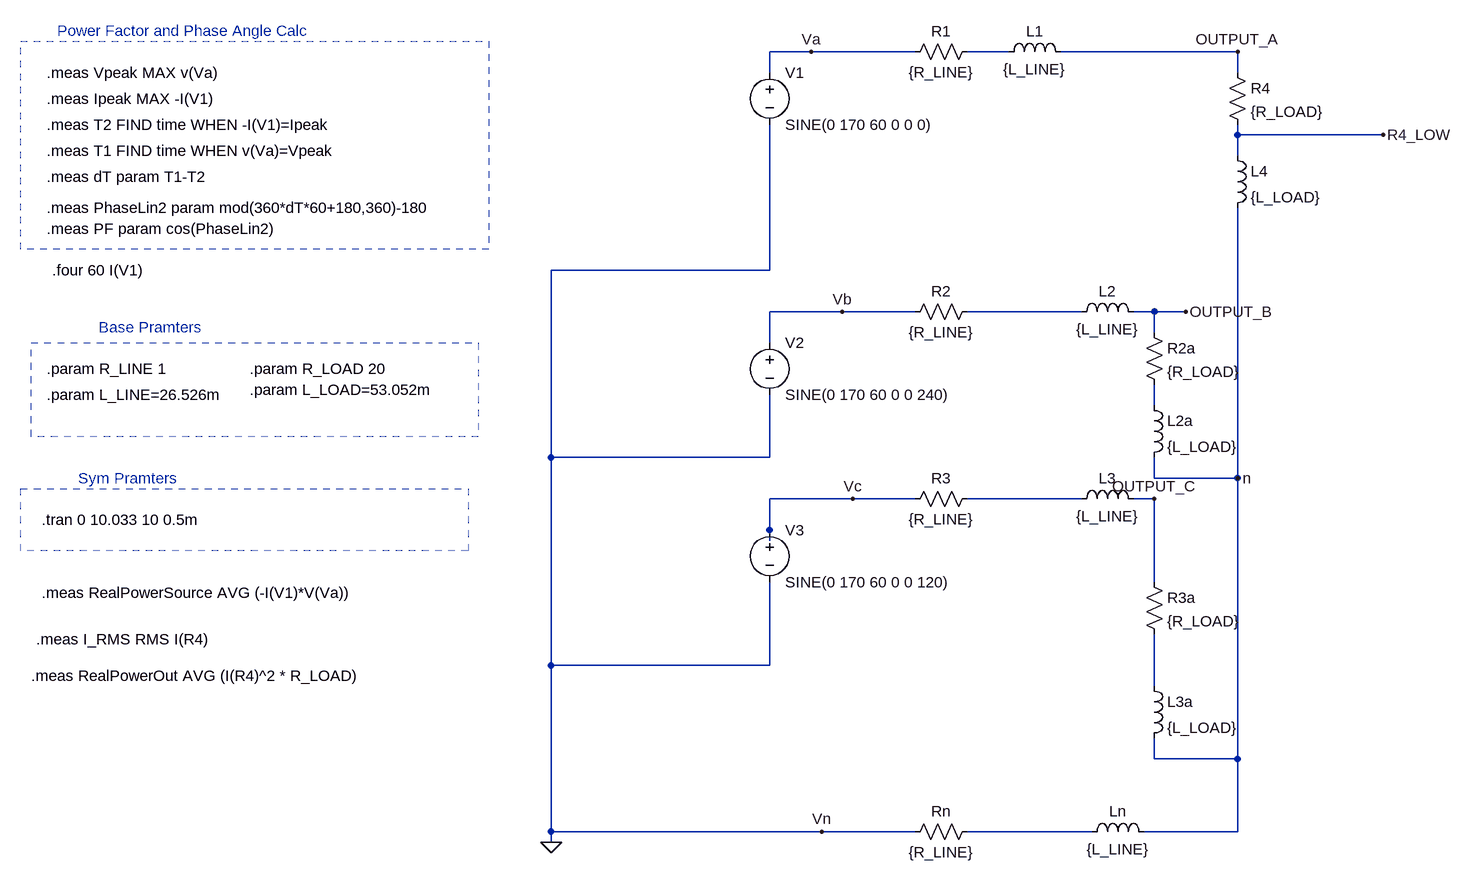
[diagram p0: schematic EE242_lab4.asc]
EE242_lab4.asc, the LTspice schematic file:
Version 4
SHEET 1 1396 1336
WIRE 192 -96 128 -96
WIRE 352 -96 192 -96
WIRE 496 -96 432 -96
WIRE 848 -96 576 -96
WIRE 128 -64 128 -96
WIRE 848 -64 848 -96
WIRE 848 32 848 16
WIRE 1072 32 848 32
WIRE 848 64 848 32
WIRE 128 240 128 16
WIRE 128 240 -208 240
WIRE 240 304 128 304
WIRE 352 304 240 304
WIRE 608 304 432 304
WIRE 720 304 688 304
WIRE 768 304 720 304
WIRE 720 336 720 304
WIRE 128 352 128 304
WIRE 720 448 720 416
WIRE -208 528 -208 240
WIRE 128 528 128 432
WIRE 128 528 -208 528
WIRE 720 560 720 528
WIRE 848 560 848 144
WIRE 848 560 720 560
WIRE 256 592 128 592
WIRE 352 592 256 592
WIRE 608 592 432 592
WIRE 720 592 688 592
WIRE 128 640 128 592
WIRE 128 656 128 640
WIRE 720 720 720 592
WIRE -208 848 -208 528
WIRE 128 848 128 720
WIRE 128 848 -208 848
WIRE 720 880 720 800
WIRE 720 992 720 960
WIRE 848 992 848 560
WIRE 848 992 720 992
WIRE -208 1104 -208 848
WIRE 208 1104 -208 1104
WIRE 352 1104 208 1104
WIRE 624 1104 432 1104
WIRE 848 1104 848 992
WIRE 848 1104 704 1104
WIRE -208 1120 -208 1104
FLAG -208 1120 0
FLAG 240 304 Vb
FLAG 256 592 Vc
FLAG 208 1104 Vn
FLAG 848 560 n
FLAG 720 592 OUTPUT_C
FLAG 768 304 OUTPUT_B
FLAG 848 -96 OUTPUT_A
FLAG 192 -96 Va
FLAG 1072 32 R4_LOW
SYMBOL voltage 128 336 R0
SYMATTR InstName V2
SYMATTR Value SINE(0 170 60 0 0 240)
SYMBOL voltage 128 624 R0
SYMATTR InstName V3
SYMATTR Value SINE(0 170 60 0 0 120)
SYMBOL res 448 576 R90
WINDOW 0 0 56 VBottom 2
WINDOW 3 32 56 VTop 2
SYMATTR InstName R3
SYMATTR Value {R_LINE}
SYMBOL res 448 288 R90
WINDOW 0 0 56 VBottom 2
WINDOW 3 32 56 VTop 2
SYMATTR InstName R2
SYMATTR Value {R_LINE}
SYMBOL res 448 1088 R90
WINDOW 0 0 56 VBottom 2
WINDOW 3 32 56 VTop 2
SYMATTR InstName Rn
SYMATTR Value {R_LINE}
SYMBOL ind 608 1120 R270
WINDOW 0 32 56 VTop 2
WINDOW 3 5 56 VBottom 2
SYMATTR InstName Ln
SYMATTR Value {L_LINE}
SYMBOL ind 592 608 R270
WINDOW 0 32 56 VTop 2
WINDOW 3 5 56 VBottom 2
SYMATTR InstName L3
SYMATTR Value {L_LINE}
SYMBOL ind 592 320 R270
WINDOW 0 32 56 VTop 2
WINDOW 3 5 56 VBottom 2
SYMATTR InstName L2
SYMATTR Value {L_LINE}
SYMBOL ind 704 432 R0
SYMATTR InstName L2a
SYMATTR Value {L_LOAD}
SYMBOL ind 704 864 R0
SYMATTR InstName L3a
SYMATTR Value {L_LOAD}
SYMBOL res 704 704 R0
SYMATTR InstName R3a
SYMATTR Value {R_LOAD}
SYMBOL res 704 320 R0
SYMATTR InstName R2a
SYMATTR Value {R_LOAD}
SYMBOL res 448 -112 R90
WINDOW 0 0 56 VBottom 2
WINDOW 3 32 56 VTop 2
SYMATTR InstName R1
SYMATTR Value {R_LINE}
SYMBOL ind 480 -80 R270
WINDOW 0 32 56 VTop 2
WINDOW 3 5 56 VBottom 2
SYMATTR InstName L1
SYMATTR Value {L_LINE}
SYMBOL res 832 -80 R0
SYMATTR InstName R4
SYMATTR Value {R_LOAD}
SYMBOL ind 832 48 R0
SYMATTR InstName L4
SYMATTR Value {L_LOAD}
SYMBOL voltage 128 -80 R0
SYMATTR InstName V1
SYMATTR Value SINE(0 170 60 0 0 0)
TEXT -992 624 Left 2 !.tran 0 10.033 10 0.5m
TEXT -984 392 Left 2 !.param R_LINE 1
TEXT -984 432 Left 2 !.param L_LINE=26.526m
TEXT -672 392 Left 2 !.param R_LOAD 20
TEXT -672 424 Left 2 !.param L_LOAD=53.052m
TEXT -984 -64 Left 2 !.meas Vpeak MAX v(Va)
TEXT -984 -24 Left 2 !.meas Ipeak MAX -I(V1)
TEXT -984 16 Left 2 !.meas T2 FIND time WHEN -I(V1)=Ipeak
TEXT -984 56 Left 2 !.meas T1 FIND time WHEN v(Va)=Vpeak
TEXT -984 96 Left 2 !.meas dT param T1-T2
TEXT -984 144 Left 2 !.meas PhaseLin2 param mod(360*dT*60+180,360)-180
TEXT -984 176 Left 2 !.meas PF param cos(PhaseLin2)
TEXT -968 -128 Left 2 ;Power Factor and Phase Angle Calc
TEXT -904 328 Left 2 ;Base Pramters
TEXT -936 560 Left 2 ;Sym Pramters
TEXT -992 736 Left 2 !.meas RealPowerSource AVG (-I(V1)*V(Va))
TEXT -1008 864 Left 2 !.meas RealPowerOut AVG (I(R4)^2 * R_LOAD)
TEXT -976 240 Left 2 !.four 60 I(V1)
TEXT -1000 808 Left 2 !.meas I_RMS RMS I(R4)
RECTANGLE Normal -304 208 -1024 -112 3
RECTANGLE Normal -320 496 -1008 352 3
RECTANGLE Normal -336 672 -1024 576 3

The netlist it stands for:
* EE242_lab4.asc
V2 Vb 0 SINE(0 170 60 0 0 240)
V3 Vc 0 SINE(0 170 60 0 0 120)
R3 N004 Vc {R_LINE}
R2 N002 Vb {R_LINE}
Rn N006 0 {R_LINE}
Ln N006 n {L_LINE}
L3 N004 OUTPUT_C {L_LINE}
L2 N002 OUTPUT_B {L_LINE}
L2a N003 n {L_LOAD}
L3a N005 n {L_LOAD}
R3a OUTPUT_C N005 {R_LOAD}
R2a OUTPUT_B N003 {R_LOAD}
R1 N001 Va {R_LINE}
L1 N001 OUTPUT_A {L_LINE}
R4 OUTPUT_A R4_LOW {R_LOAD}
L4 R4_LOW n {L_LOAD}
V1 Va 0 SINE(0 170 60 0 0 0)
.tran 0 10.033 10 0.5m
.param R_LINE 1
.param L_LINE=26.526m
.param R_LOAD 20
.param L_LOAD=53.052m
.meas Vpeak MAX v(Va)
.meas Ipeak MAX -I(V1)
.meas T2 FIND time WHEN -I(V1)=Ipeak
.meas T1 FIND time WHEN v(Va)=Vpeak
.meas dT param T1-T2
.meas PhaseLin2 param mod(360*dT*60+180,360)-180
.meas PF param cos(PhaseLin2)
* Power Factor and Phase Angle Calc
* Base Pramters
* Sym Pramters
.meas RealPowerSource AVG (-I(V1)*V(Va))
.meas RealPowerOut AVG (I(R4)^2 * R_LOAD)
.four 60 I(V1)
.meas I_RMS RMS I(R4)
.backanno
.end